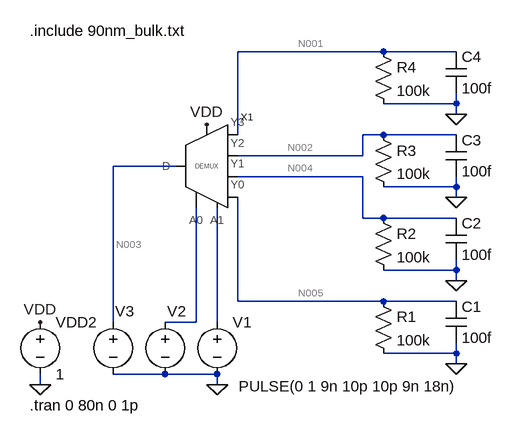
[diagram p0: schematic test_demux1to4.asc]
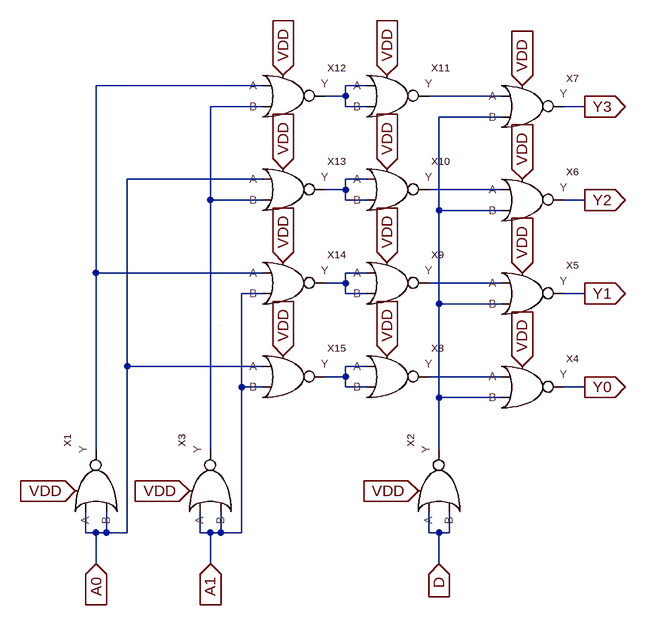
[diagram p1: sub-circuit demux1to4.asc]
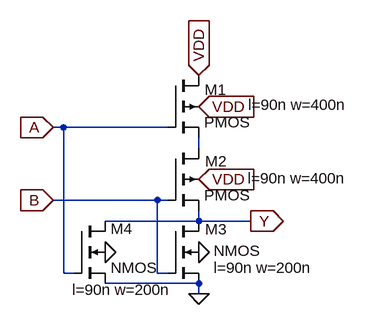
[diagram p2: sub-circuit nor.asc]
test_demux1to4.asc, the LTspice schematic file:
Version 4
SHEET 1 880 680
WIRE 352 -352 128 -352
WIRE 464 -352 352 -352
WIRE 464 -272 464 -288
WIRE 464 -272 352 -272
WIRE 464 -256 464 -272
WIRE 128 -224 128 -352
WIRE 352 -224 320 -224
WIRE 464 -224 352 -224
WIRE 320 -192 320 -224
WIRE 320 -192 128 -192
WIRE 32 -176 -64 -176
WIRE 320 -160 128 -160
WIRE 464 -144 464 -160
WIRE 464 -144 352 -144
WIRE 464 -128 464 -144
WIRE 320 -96 320 -160
WIRE 352 -96 320 -96
WIRE 464 -96 352 -96
WIRE 464 -16 464 -32
WIRE 464 -16 352 -16
WIRE 464 0 464 -16
WIRE 128 32 128 -128
WIRE 352 32 128 32
WIRE 464 32 352 32
WIRE -64 64 -64 -176
WIRE 64 64 64 -112
WIRE 64 64 16 64
WIRE 96 64 96 -112
WIRE 464 112 464 96
WIRE 464 112 352 112
WIRE 464 128 464 112
WIRE 16 144 -64 144
WIRE 96 144 16 144
WIRE -176 160 -176 144
WIRE 96 160 96 144
FLAG 96 160 0
FLAG -176 160 0
FLAG -176 64 VDD
FLAG 464 128 0
FLAG 464 0 0
FLAG 464 -128 0
FLAG 464 -256 0
FLAG 80 -240 VDD
SYMBOL voltage 96 48 R0
WINDOW 123 0 0 Left 0
WINDOW 39 0 0 Left 0
WINDOW 3 33 115 Left 2
SYMATTR Value PULSE(0 1 9n 10p 10p 9n 18n)
SYMATTR InstName V1
SYMBOL voltage -176 48 R0
WINDOW 123 0 0 Left 0
WINDOW 39 0 0 Left 0
SYMATTR InstName VDD2
SYMATTR Value 1
SYMBOL res 336 16 R0
SYMATTR InstName R1
SYMATTR Value 100k
SYMBOL cap 448 32 R0
SYMATTR InstName C1
SYMATTR Value 100f
SYMBOL res 336 -112 R0
SYMATTR InstName R2
SYMATTR Value 100k
SYMBOL cap 448 -96 R0
SYMATTR InstName C2
SYMATTR Value 100f
SYMBOL res 336 -240 R0
SYMATTR InstName R3
SYMATTR Value 100k
SYMBOL cap 448 -224 R0
SYMATTR InstName C3
SYMATTR Value 100f
SYMBOL res 336 -368 R0
SYMATTR InstName R4
SYMATTR Value 100k
SYMBOL cap 448 -352 R0
SYMATTR InstName C4
SYMATTR Value 100f
SYMBOL demux1to4 80 -176 R0
SYMATTR InstName X1
SYMBOL voltage 16 48 R0
WINDOW 123 0 0 Left 0
WINDOW 39 0 0 Left 0
WINDOW 3 32 94 Invisible 2
WINDOW 0 3 -1 Left 2
SYMATTR Value PULSE(0 1 18n 10p 10p 18n 36n)
SYMATTR InstName V2
SYMBOL voltage -64 48 R0
WINDOW 123 0 0 Left 0
WINDOW 39 0 0 Left 0
WINDOW 3 32 94 Invisible 2
WINDOW 0 3 -1 Left 2
SYMATTR Value PULSE(0 1 36n 10p 10p 36n 72n)
SYMATTR InstName V3
TEXT -192 -384 Left 2 !.include 90nm_bulk.txt
TEXT -192 192 Left 2 !.tran 0 80n 0 1p

demux1to4.asc, the sub-circuit schematic file:
Version 4
SHEET 1 880 680
WIRE 64 -368 -192 -368
WIRE 224 -368 192 -368
WIRE 192 -352 192 -368
WIRE 192 -352 160 -352
WIRE 432 -352 320 -352
WIRE 64 -336 -16 -336
WIRE 192 -336 192 -352
WIRE 224 -336 192 -336
WIRE 560 -336 528 -336
WIRE 432 -320 336 -320
WIRE 64 -224 -144 -224
WIRE 224 -224 192 -224
WIRE 192 -208 192 -224
WIRE 192 -208 160 -208
WIRE 432 -208 320 -208
WIRE -16 -192 -16 -336
WIRE 64 -192 -16 -192
WIRE 192 -192 192 -208
WIRE 224 -192 192 -192
WIRE 560 -192 528 -192
WIRE 336 -176 336 -320
WIRE 432 -176 336 -176
WIRE -192 -80 -192 -368
WIRE 64 -80 -192 -80
WIRE 224 -80 192 -80
WIRE 192 -64 192 -80
WIRE 192 -64 160 -64
WIRE 432 -64 320 -64
WIRE 64 -48 32 -48
WIRE 192 -48 192 -64
WIRE 224 -48 192 -48
WIRE 560 -48 528 -48
WIRE 336 -32 336 -176
WIRE 432 -32 336 -32
WIRE -144 64 -144 -224
WIRE 64 64 -144 64
WIRE 224 64 192 64
WIRE 192 80 192 64
WIRE 192 80 160 80
WIRE 432 80 320 80
WIRE 32 96 32 -48
WIRE 64 96 32 96
WIRE 192 96 192 80
WIRE 224 96 192 96
WIRE 560 96 528 96
WIRE 336 112 336 -32
WIRE 432 112 336 112
WIRE -192 192 -192 -80
WIRE -16 192 -16 -192
WIRE 336 192 336 112
WIRE -208 320 -208 288
WIRE -192 320 -208 320
WIRE -176 320 -176 288
WIRE -176 320 -192 320
WIRE -144 320 -144 64
WIRE -144 320 -176 320
WIRE -32 320 -32 288
WIRE -16 320 -32 320
WIRE 0 320 0 288
WIRE 0 320 -16 320
WIRE 32 320 32 96
WIRE 32 320 0 320
WIRE 320 320 320 288
WIRE 336 320 320 320
WIRE 352 320 352 288
WIRE 352 320 336 320
WIRE -192 368 -192 320
WIRE -16 368 -16 320
WIRE 336 368 336 320
WIRE 0 0 0 0
FLAG 560 96 Y0
IOPIN 560 96 Out
FLAG 560 -48 Y1
IOPIN 560 -48 Out
FLAG 560 -192 Y2
IOPIN 560 -192 Out
FLAG 560 -336 Y3
IOPIN 560 -336 Out
FLAG -192 368 A0
IOPIN -192 368 In
FLAG -16 368 A1
IOPIN -16 368 In
FLAG -48 256 VDD
IOPIN -48 256 In
FLAG 336 368 D
IOPIN 336 368 In
FLAG -224 256 VDD
IOPIN -224 256 In
FLAG 304 256 VDD
IOPIN 304 256 In
FLAG 464 64 VDD
IOPIN 464 64 In
FLAG 464 -80 VDD
IOPIN 464 -80 In
FLAG 464 -224 VDD
IOPIN 464 -224 In
FLAG 464 -368 VDD
IOPIN 464 -368 In
FLAG 256 -384 VDD
IOPIN 256 -384 In
FLAG 256 -240 VDD
IOPIN 256 -240 In
FLAG 256 -96 VDD
IOPIN 256 -96 In
FLAG 256 48 VDD
IOPIN 256 48 In
FLAG 96 -384 VDD
IOPIN 96 -384 In
FLAG 96 -240 VDD
IOPIN 96 -240 In
FLAG 96 -96 VDD
IOPIN 96 -96 In
FLAG 96 48 VDD
IOPIN 96 48 In
SYMBOL nor -192 256 R270
SYMATTR InstName X1
SYMBOL nor -16 256 R270
SYMATTR InstName X3
SYMBOL nor 336 256 R270
SYMATTR InstName X2
SYMBOL nor 464 96 R0
SYMATTR InstName X4
SYMBOL nor 464 -48 R0
SYMATTR InstName X5
SYMBOL nor 464 -192 R0
SYMATTR InstName X6
SYMBOL nor 464 -336 R0
SYMATTR InstName X7
SYMBOL nor 256 80 R0
SYMATTR InstName X8
SYMBOL nor 256 -64 R0
SYMATTR InstName X9
SYMBOL nor 256 -208 R0
SYMATTR InstName X10
SYMBOL nor 256 -352 R0
SYMATTR InstName X11
SYMBOL nor 96 -352 R0
SYMATTR InstName X12
SYMBOL nor 96 -208 R0
SYMATTR InstName X13
SYMBOL nor 96 -64 R0
SYMATTR InstName X14
SYMBOL nor 96 80 R0
SYMATTR InstName X15

nor.asc, the sub-circuit schematic file:
Version 4
SHEET 1 880 680
WIRE 16 -176 0 -176
WIRE 176 -176 16 -176
WIRE 224 -144 224 -160
WIRE 160 -64 0 -64
WIRE 176 -64 160 -64
WIRE 224 -32 224 -48
WIRE 224 -32 80 -32
WIRE 304 -32 224 -32
WIRE 16 48 16 -176
WIRE 32 48 16 48
WIRE 160 48 160 -64
WIRE 176 48 160 48
WIRE 224 64 80 64
WIRE 224 80 224 64
FLAG 0 -176 A
IOPIN 0 -176 In
FLAG 0 -64 B
IOPIN 0 -64 In
FLAG 224 -256 VDD
IOPIN 224 -256 In
FLAG 304 -32 Y
IOPIN 304 -32 Out
FLAG 224 -208 VDD
IOPIN 224 -208 In
FLAG 224 -96 VDD
IOPIN 224 -96 In
FLAG 224 16 0
FLAG 80 16 0
FLAG 224 80 0
SYMBOL pmos4 176 -256 R0
WINDOW 123 124 45 Left 2
WINDOW 0 57 22 Left 2
SYMATTR Value2 l=90n w=400n
SYMATTR InstName M1
SYMBOL pmos4 176 -144 R0
WINDOW 123 123 46 Left 2
WINDOW 0 58 20 Left 2
SYMATTR Value2 l=90n w=400n
SYMATTR InstName M2
SYMBOL nmos4 176 -32 R0
WINDOW 123 71 72 Left 2
WINDOW 0 58 13 Left 2
WINDOW 3 71 46 Left 2
SYMATTR Value2 l=90n w=200n
SYMATTR InstName M3
SYMBOL nmos4 32 -32 R0
WINDOW 123 -3 106 Left 2
WINDOW 0 56 12 Left 2
SYMATTR Value2 l=90n w=200n
SYMATTR InstName M4

The netlist it stands for:
* test_demux1to4.asc
V1 N007 0 PULSE(0 1 9n 10p 10p 9n 18n)
VDD2 VDD 0 1
R1 N005 0 100k
C1 N005 0 100f
R2 N004 0 100k
C2 N004 0 100f
R3 N002 0 100k
C3 N002 0 100f
R4 N001 0 100k
C4 N001 0 100f
XX1 N001 N002 N004 N005 N006 N007 N003 VDD demux1to4
V2 N006 0 PULSE(0 1 18n 10p 10p 18n 36n)
V3 N003 0 PULSE(0 1 36n 10p 10p 36n 72n)

* block symbol definitions
.subckt demux1to4 Y3 Y2 Y1 Y0 A0 A1 D VDD
XX1 A0 A0 VDD N001 nor
XX3 A1 A1 VDD N004 nor
XX2 D D VDD N005 nor
XX4 N011 N005 VDD Y0 nor
XX5 N009 N005 VDD Y1 nor
XX6 N007 N005 VDD Y2 nor
XX7 N003 N005 VDD Y3 nor
XX8 N010 N010 VDD N011 nor
XX9 N008 N008 VDD N009 nor
XX10 N006 N006 VDD N007 nor
XX11 N002 N002 VDD N003 nor
XX12 N001 N004 VDD N002 nor
XX13 A0 N004 VDD N006 nor
XX14 N001 A1 VDD N008 nor
XX15 A0 A1 VDD N010 nor
.ends demux1to4

.subckt nor A B VDD Y
M1 VDD A N001 VDD PMOS l=90n w=400n
M2 N001 B Y VDD PMOS l=90n w=400n
M3 Y B 0 0 NMOS l=90n w=200n
M4 Y A 0 0 NMOS l=90n w=200n
.ends nor

.model NMOS NMOS
.model PMOS PMOS
.lib standard.mos
.include 90nm_bulk.txt
.tran 0 80n 0 1p
.backanno
.end

* Results of the author's LTspice run, read from the files saved beside the schematic
* Operating Point, zero values left out:
*   V(vdd) = 1 V
*   V(n005) = 3.34 µV
*   V(n004) = 150.7 nV
*   V(n002) = 150.7 nV
*   V(n001) = 150.7 nV
*   I(R4) = 1.507 pA
*   I(R3) = 1.507 pA
*   I(R2) = 1.507 pA
*   I(R1) = 33.4 pA
*   I(Vdd2) = -18.17 nA
*   Ix(x1:Y3) = -1.508 pA
*   Ix(x1:Y2) = -1.509 pA
*   Ix(x1:Y1) = -1.508 pA
*   Ix(x1:Y0) = -33.4 pA
*   Ix(x1:VDD) = 18.17 nA
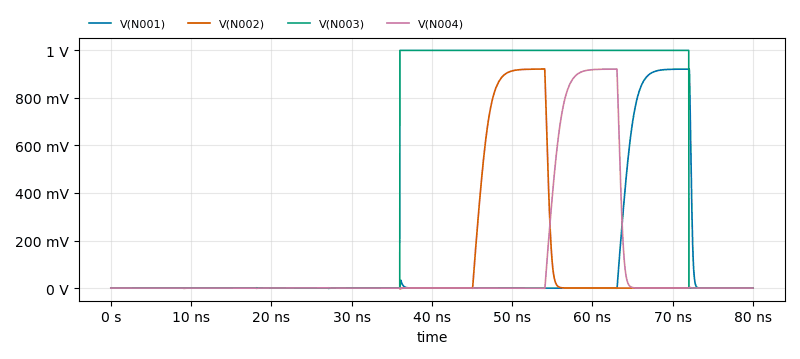
[diagram p3: Transient Analysis of test_demux1to4.asc, plotted from the saved traces]
* Transient Analysis, 1 run:
*   V(N001): min -1.837 mV, max 922.6 mV, average 91.44 mV, rms 277.5 mV, last 1.901 µV
*   V(N002): min -2.974 mV, max 921.9 mV, average 93.7 mV, rms 279.7 mV, last 0 V
*   V(N003): min 0 V, max 1 V, average 450.1 mV, rms 670.9 mV, last 0 V
*   V(N004): min -3.212 mV, max 921.9 mV, average 93.58 mV, rms 279.5 mV, last 0 V